# Altium schematic sheet TC358779XBG.SchDoc
size Letter
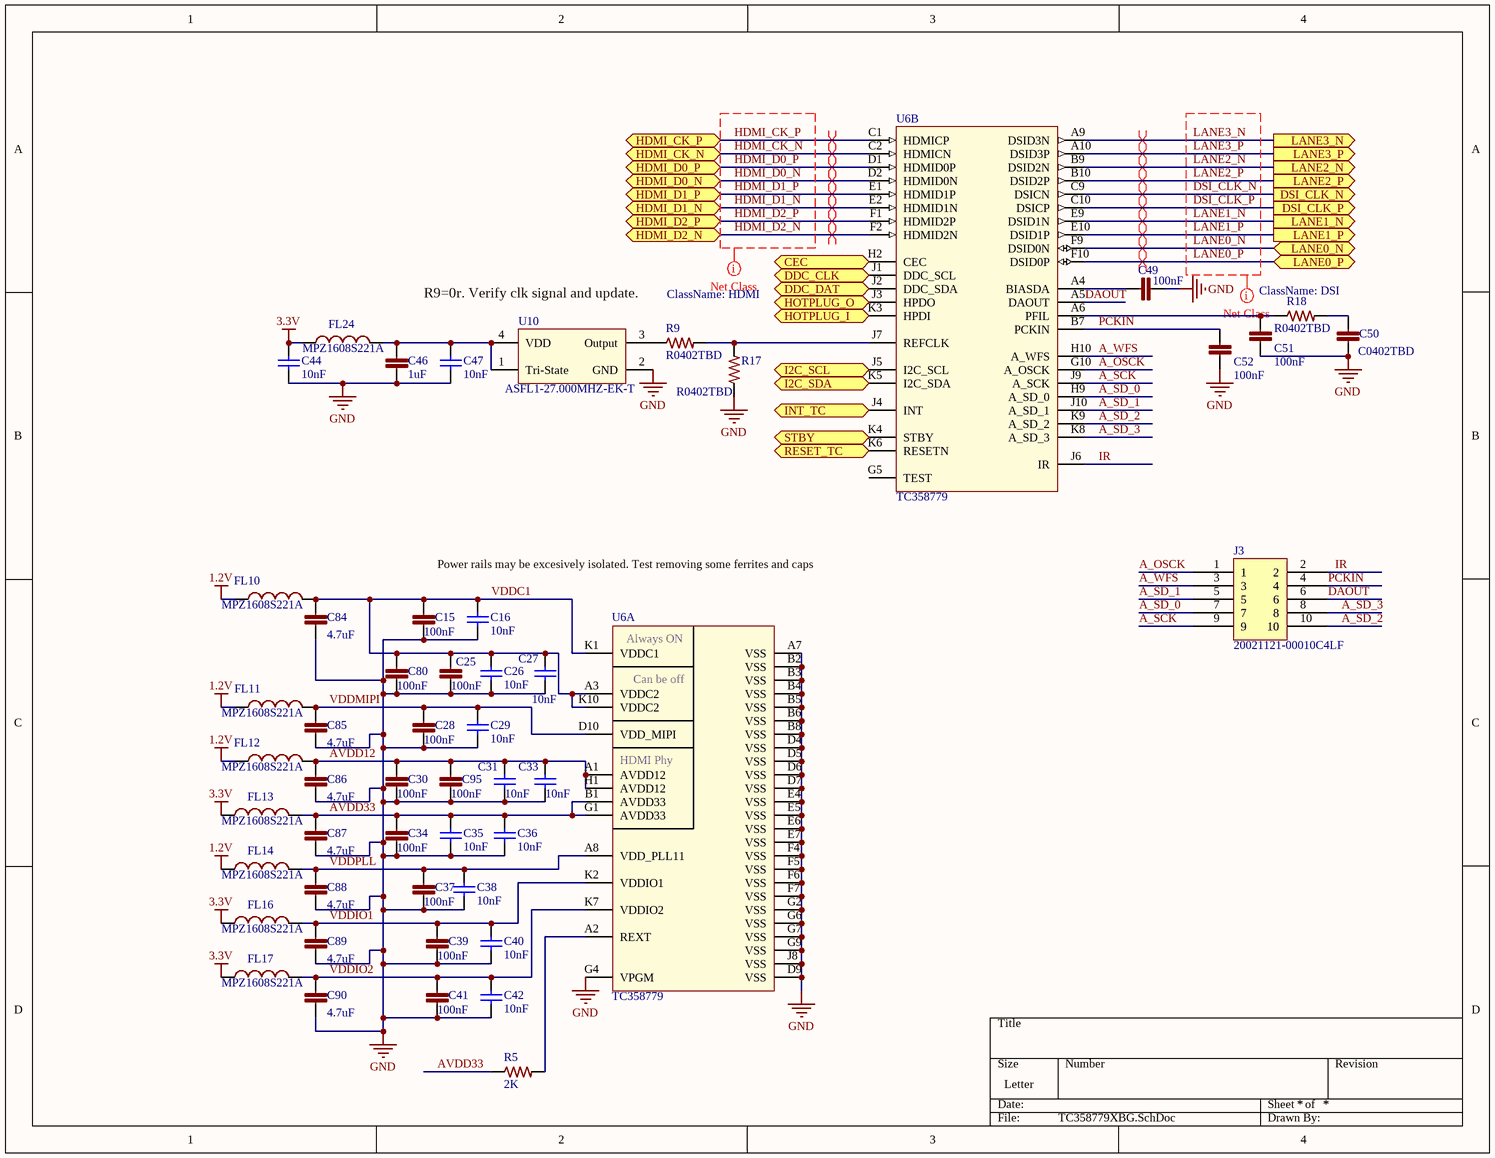
[diagram p0: TC358779XBG.SchDoc]

## Parts
C15  100nF  [C0402]
C16  10nF  [C0402]
C25  100nF  [C0402]
C26  10nF  [C0402]
C27  10nF  [C0402]
C28  100nF  [C0402]
C29  10nF  [C0402]
C30  100nF  [C0402]
C31  10nF  [C0402]
C33  10nF  [C0402]
C34  100nF  [C0402]
C35  10nF  [C0402]
C36  10nF  [C0402]
C37  100nF  [C0402]
C38  10nF  [C0402]
C39  100nF  [C0402]
C40  10nF  [C0402]
C41  100nF  [C0402]
C42  10nF  [C0402]
C44  10nF  [C0402]
C46  1uF  [C0402]
C47  10nF  [C0402]
C49  100nF  [C0402]
C50  C0402TBD  [C0402]
C51  100nF  [C0402]
C52  100nF  [C0402]
C80  100nF  [C0402]
C84  4.7uF  [C0603]
C85  4.7uF  [C0603]
C86  4.7uF  [C0603]
C87  4.7uF  [C0603]
C88  4.7uF  [C0603]
C89  4.7uF  [C0603]
C90  4.7uF  [C0603]
C95  100nF  [C0402]
FL10  MPZ1608S221A  [C0603]
FL11  MPZ1608S221A  [C0603]
FL12  MPZ1608S221A  [C0603]
FL13  MPZ1608S221A  [C0603]
FL14  MPZ1608S221A  [C0603]
FL16  MPZ1608S221A  [C0603]
FL17  MPZ1608S221A  [C0603]
FL24  MPZ1608S221A  [C0603]
J3  20021121-00010C4LF  [FTSH-105-XX-X-DV]
R5  2K  [R0402]
R9  R0402TBD  [R0402]
R17  R0402TBD  [R0402]
R18  R0402TBD  [R0402]
U6  TC358779  [BGA80-0707-065]  (parts A,B of 2)
U10  ASFL1-27.000MHZ-EK-T  [OSC-5x3.2x1.3]

## Ports
CEC, DDC_CLK, DDC_DAT, DSI_CLK_N (out), DSI_CLK_P (out), HDMI_CK_N, HDMI_CK_P, HDMI_D0_N, HDMI_D0_P, HDMI_D1_N, HDMI_D1_P, HDMI_D2_N, HDMI_D2_P, HOTPLUG_I, HOTPLUG_O, I2C_SCL, I2C_SDA, INT_TC, LANE0_N (bidir), LANE0_P (bidir), LANE1_N (out), LANE1_P (out), LANE2_N (out), LANE2_P (out), LANE3_N (out), LANE3_P (out), RESET_TC, STBY

## Nets
1.2V: FL10.1 FL11.1 FL12.1 FL14.1
3.3V: C44.2 FL13.1 FL16.1 FL17.1 FL24.2
GND: C15.2 C16.1 C25.2 C26.1 C27.1 C28.2 C29.1 C30.2 C31.1 C33.1 C34.2 C35.1 C36.1 C37.2 C38.1 C39.2 C40.1 C41.2 C42.1 C44.1 C46.2 C47.1 C49.2 C50.2 C51.2 C52.2 C80.2 C84.2 C85.2 C86.2 C87.2 C88.2 C89.2 C90.2 C95.2 R17.1 U6.A7(VSS) U6.B2(VSS) U6.B3(VSS) U6.B4(VSS) U6.B5(VSS) U6.B6(VSS) U6.B8(VSS) U6.D4(VSS) U6.D5(VSS) U6.D6(VSS) U6.D7(VSS) U6.D9(VSS) U6.E4(VSS) U6.E5(VSS) U6.E6(VSS) U6.E7(VSS) U6.F4(VSS) U6.F5(VSS) U6.F6(VSS) U6.F7(VSS) U6.G2(VSS) U6.G4(VPGM) U6.G6(VSS) U6.G7(VSS) U6.G9(VSS) U6.J8(VSS) U10.2(GND)
A_OSCK: J3.1 U6.G10(A_OSCK)
A_SCK: J3.9 U6.J9(A_SCK)
A_SD_0: J3.7 U6.H9(A_SD_0)
A_SD_1: J3.5 U6.J10(A_SD_1)
A_SD_2: J3.10 U6.K9(A_SD_2)
A_SD_3: J3.8 U6.K8(A_SD_3)
A_WFS: J3.3 U6.H10(A_WFS)
AVDD12: C30.1 C31.2 C33.2 C86.1 C95.1 FL12.2 U6.A1(AVDD12) U6.H1(AVDD12)
AVDD33: C34.1 C35.2 C36.2 C87.1 FL13.2 R5.1 U6.B1(AVDD33) U6.G1(AVDD33)
CEC: U6.H2(CEC) ; port CEC
DAOUT: J3.6 U6.A5(DAOUT)
DDC_CLK: U6.J1(DDC_SCL) ; port DDC_CLK
DDC_DAT: U6.J2(DDC_SDA) ; port DDC_DAT
DSI_CLK_N: U6.C9(DSICN) ; port DSI_CLK_N
DSI_CLK_P: U6.C10(DSICP) ; port DSI_CLK_P
HDMI_CK_N: U6.C2(HDMICN) ; port HDMI_CK_N
HDMI_CK_P: U6.C1(HDMICP) ; port HDMI_CK_P
HDMI_D0_N: U6.D2(HDMID0N) ; port HDMI_D0_N
HDMI_D0_P: U6.D1(HDMID0P) ; port HDMI_D0_P
HDMI_D1_N: U6.E2(HDMID1N) ; port HDMI_D1_N
HDMI_D1_P: U6.E1(HDMID1P) ; port HDMI_D1_P
HDMI_D2_N: U6.F2(HDMID2N) ; port HDMI_D2_N
HDMI_D2_P: U6.F1(HDMID2P) ; port HDMI_D2_P
HOTPLUG_I: U6.K3(HPDI) ; port HOTPLUG_I
HOTPLUG_O: U6.J3(HPDO) ; port HOTPLUG_O
I2C_SCL: U6.J5(I2C_SCL) ; port I2C_SCL
I2C_SDA: U6.K5(I2C_SDA) ; port I2C_SDA
INT_TC: U6.J4(INT) ; port INT_TC
IR: J3.2 U6.J6(IR)
LANE0_N: U6.F9(DSID0N) ; port LANE0_N
LANE0_P: U6.F10(DSID0P) ; port LANE0_P
LANE1_N: U6.E9(DSID1N) ; port LANE1_N
LANE1_P: U6.E10(DSID1P) ; port LANE1_P
LANE2_N: U6.B9(DSID2N) ; port LANE2_N
LANE2_P: U6.B10(DSID2P) ; port LANE2_P
LANE3_N: U6.A9(DSID3N) ; port LANE3_N
LANE3_P: U6.A10(DSID3P) ; port LANE3_P
PCKIN: C52.1 J3.4 U6.B7(PCKIN)
RESET_TC: U6.K6(RESETN) ; port RESET_TC
STBY: U6.K4(STBY) ; port STBY
VDDC1: C15.1 C16.2 C25.1 C26.2 C27.2 C80.1 C84.1 FL10.2 U6.A3(VDDC2) U6.K1(VDDC1) U6.K10(VDDC2)
VDDIO1: C39.1 C40.2 C89.1 FL16.2 U6.K2(VDDIO1)
VDDIO2: C41.1 C42.2 C90.1 FL17.2 U6.K7(VDDIO2)
VDDMIPI: C28.1 C29.2 C85.1 FL11.2 U6.D10(VDD_MIPI)
VDDPLL: C37.1 C38.2 C88.1 FL14.2 U6.A8(VDD_PLL11)
NetC46_1: C46.1 C47.2 FL24.1 U10.1(Tri-State) U10.4(VDD)
NetC49_1: C49.1 U6.A4(BIASDA)
NetC50_1: C50.1 R18.2
NetC51_1: C51.1 R18.1 U6.A6(PFIL)
NetR5_2: R5.2 U6.A2(REXT)
NetR9_1: R9.1 U10.3(Output)
NetR9_2: R9.2 R17.2 U6.J7(REFCLK)

Not connected (* = marked no-connect by the designer): U6 G5(TEST)

## Layout directives
differential pair: DSI_CLK_N, DSI_CLK_P, HDMI_CK_N, HDMI_CK_P, HDMI_D0_N, HDMI_D0_P, HDMI_D1_N, HDMI_D1_P, HDMI_D2_N, HDMI_D2_P, LANE0_N, LANE0_P, LANE1_N, LANE1_P, LANE2_N, LANE2_P, LANE3_N, LANE3_P
net class DSI: DSI_CLK_N, DSI_CLK_P, LANE0_N, LANE0_P, LANE1_N, LANE1_P, LANE2_N, LANE2_P, LANE3_N, LANE3_P
net class HDMI: HDMI_CK_N, HDMI_CK_P, HDMI_D0_N, HDMI_D0_P, HDMI_D1_N, HDMI_D1_P, HDMI_D2_N, HDMI_D2_P

## Notes on the sheet
- R9=0r. Verify clk signal and update.
- Power rails may be excesively isolated. Test removing some ferrites and caps
- (in symbol TC358779, part A) Always ON; Can be off; HDMI Phy

## Library data of the parts
C15 C25 C28 C30 C34 C37 C39 C41 C49 C51 C52 C80 C95 = GRM155R71C104KA88D: CAP CER 0402 100nF 16V 10% X7R; LastRevisionNote: ImportComponents; Published: 23-Apr-2014; Publisher: UltiMachine; LastRevisionDate: 23-Apr-2014; ManufacturerPartNumber: GRM155R71C104KA88D; VALUE: 100nF
C16 C26 C27 C29 C31 C33 C35 C36 C38 C40 C42 C44 C47 = GRM155R71H103JA88D: CAP CER 10nF 50V X7R 0402; MFR: Murata; Part Description: CAP CER 10000PF 50V X7R 0402; Tolerance: 10%; Voltage: 6.3VDC; Value: 0.01uF 50V; Published: 10 - Dec - 2014; LatestRevisionDate: 10 - Dec - 2014; LatestRevisionNote: Ultimachine Footprint Added; Publisher: Ultimachine; Component Type: Chip Capacitor; MFR Part #: GRM155R71H103JA88D; Mounting Type: SMT 0402; Datasheet: http://search.murata.co.jp/Ceramy/image/img/A01X/G101/ENG/GRM155R71H103JA88-01.pdf; Height: 0.5 ±0.05mm; Digikey #: 490-7763-1-ND; PackageReference: 0402
C46 = GRM155R60J105KE19D: CAP CER 0402 1uF 6.3V 10% X5R; LastRevisionNote: ImportComponents; Published: 23-Apr-2014; Publisher: UltiMachine; LastRevisionDate: 23-Apr-2014; ManufacturerPartNumber: GRM155R60J105KE19D; VALUE: 1uF
C50 = C0402TBD: Capacitor Non Polarized; LastRevisionNote: ImportComponents; Published: 23-Apr-2014; Publisher: UltiMachine; LastRevisionDate: 23-Apr-2014; VALUE: C0402TBD
C84-C90 = GRM188R61A475KE15D: CAP CER 4.7UF 10V X5R 0603; LastRevisionNote: ImportComponents; Published: 23-Apr-2014; Publisher: UltiMachine; LastRevisionDate: 23-Apr-2014; ManufacturerPartNumber: GRM188R61A475KE15D; VALUE: 4.7uF
FL10-FL14 FL16 FL17 FL24 = MPZ1608S221A: Ferrite; LastRevisionNote: ImportComponents; Published: 23-Apr-2014; Publisher: UltiMachine; LastRevisionDate: 23-Apr-2014; Value: MPZ1608S221A
J3 = ARM Cortex JTAG-DEBUG Header
R5 = RC0402FR-072KL: RES SMD 2K OHM 1% 1/16W 0402; ManufacturerPartNumber: RC0402FR-0710KP; LastRevisionNote: ImportComponents; Published: 23-Apr-2014; Publisher: UltiMachine; LastRevisionDate: 23-Apr-2014; VALUE: 2K
R9 R17 R18 = R0402TBD: Resistor; LastRevisionNote: ImportComponents; Published: 23-Apr-2014; Publisher: UltiMachine; LastRevisionDate: 23-Apr-2014; VALUE: R0402TBD
U10 = ASFL1-27.000MHZ-EK-T: OSC XO 27.000MHZ HCMOS TTL SMD